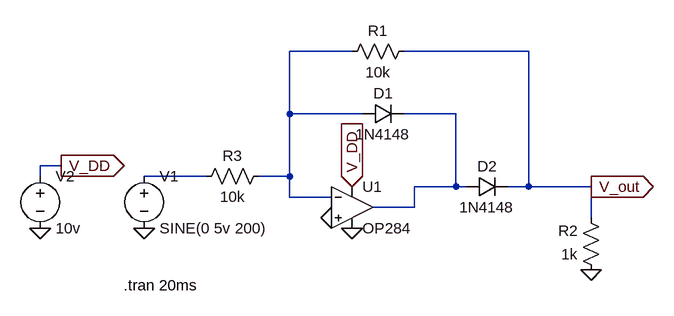
[diagram p0: schematic Precision Rectifier.asc]
Precision Rectifier.asc, the LTspice schematic file:
Version 4
SHEET 1 880 680
WIRE 176 -32 80 -32
WIRE 448 -32 256 -32
WIRE 80 64 80 -32
WIRE 192 64 80 64
WIRE 336 64 256 64
WIRE -272 144 -304 144
WIRE -304 160 -304 144
WIRE -48 160 -144 160
WIRE 80 160 80 64
WIRE 80 160 32 160
WIRE 336 176 336 64
WIRE 336 176 272 176
WIRE 352 176 336 176
WIRE 448 176 448 -32
WIRE 448 176 416 176
WIRE 544 176 448 176
WIRE 80 192 80 160
WIRE 144 192 80 192
WIRE 272 208 272 176
WIRE 272 208 208 208
WIRE 544 224 544 176
FLAG -144 240 0
FLAG 544 304 0
FLAG 544 176 V_out
IOPIN 544 176 Out
FLAG -304 240 0
FLAG -272 144 V_DD
IOPIN -272 144 Out
FLAG 144 224 0
FLAG 176 176 V_DD
IOPIN 176 176 In
FLAG 176 240 0
SYMBOL diode 192 80 R270
WINDOW 0 32 32 VTop 2
WINDOW 3 0 32 VBottom 2
SYMATTR InstName D1
SYMATTR Value 1N4148
SYMBOL res 272 -48 R90
WINDOW 0 0 56 VBottom 2
WINDOW 3 32 56 VTop 2
SYMATTR InstName R1
SYMATTR Value 10k
SYMBOL res 560 320 R180
WINDOW 0 36 76 Left 2
WINDOW 3 36 40 Left 2
SYMATTR InstName R2
SYMATTR Value 1k
SYMBOL res -64 176 R270
WINDOW 0 32 56 VTop 2
WINDOW 3 0 56 VBottom 2
SYMATTR InstName R3
SYMATTR Value 10k
SYMBOL voltage -144 144 R0
WINDOW 123 0 0 Left 0
WINDOW 39 0 0 Left 0
SYMATTR InstName V1
SYMATTR Value SINE(0 5v 200)
SYMBOL diode 352 192 R270
WINDOW 0 32 32 VTop 2
WINDOW 3 0 32 VBottom 2
SYMATTR InstName D2
SYMATTR Value 1N4148
SYMBOL voltage -304 144 R0
WINDOW 123 0 0 Left 0
WINDOW 39 0 0 Left 0
SYMATTR InstName V2
SYMATTR Value 10v
SYMBOL OpAmps\\OP284 176 144 R0
SYMATTR InstName U1
TEXT -176 328 Left 2 !.tran 20ms

The netlist it stands for:
* Precision Rectifier.asc
D1 N001 N002 1N4148
R1 V_out N001 10k
R2 0 V_out 1k
R3 N003 N001 10k
V1 N003 0 SINE(0 5v 200)
D2 N002 V_out 1N4148
V2 V_DD 0 10v
XU1 0 N001 V_DD 0 N002 OP284  ; pins In+ In- V+ V- OUT
.model D D
.lib standard.dio
.tran 20ms
.lib ADI1.lib
.backanno
.end